# Altium schematic sheet SD-eMMC.SchDoc
size A4
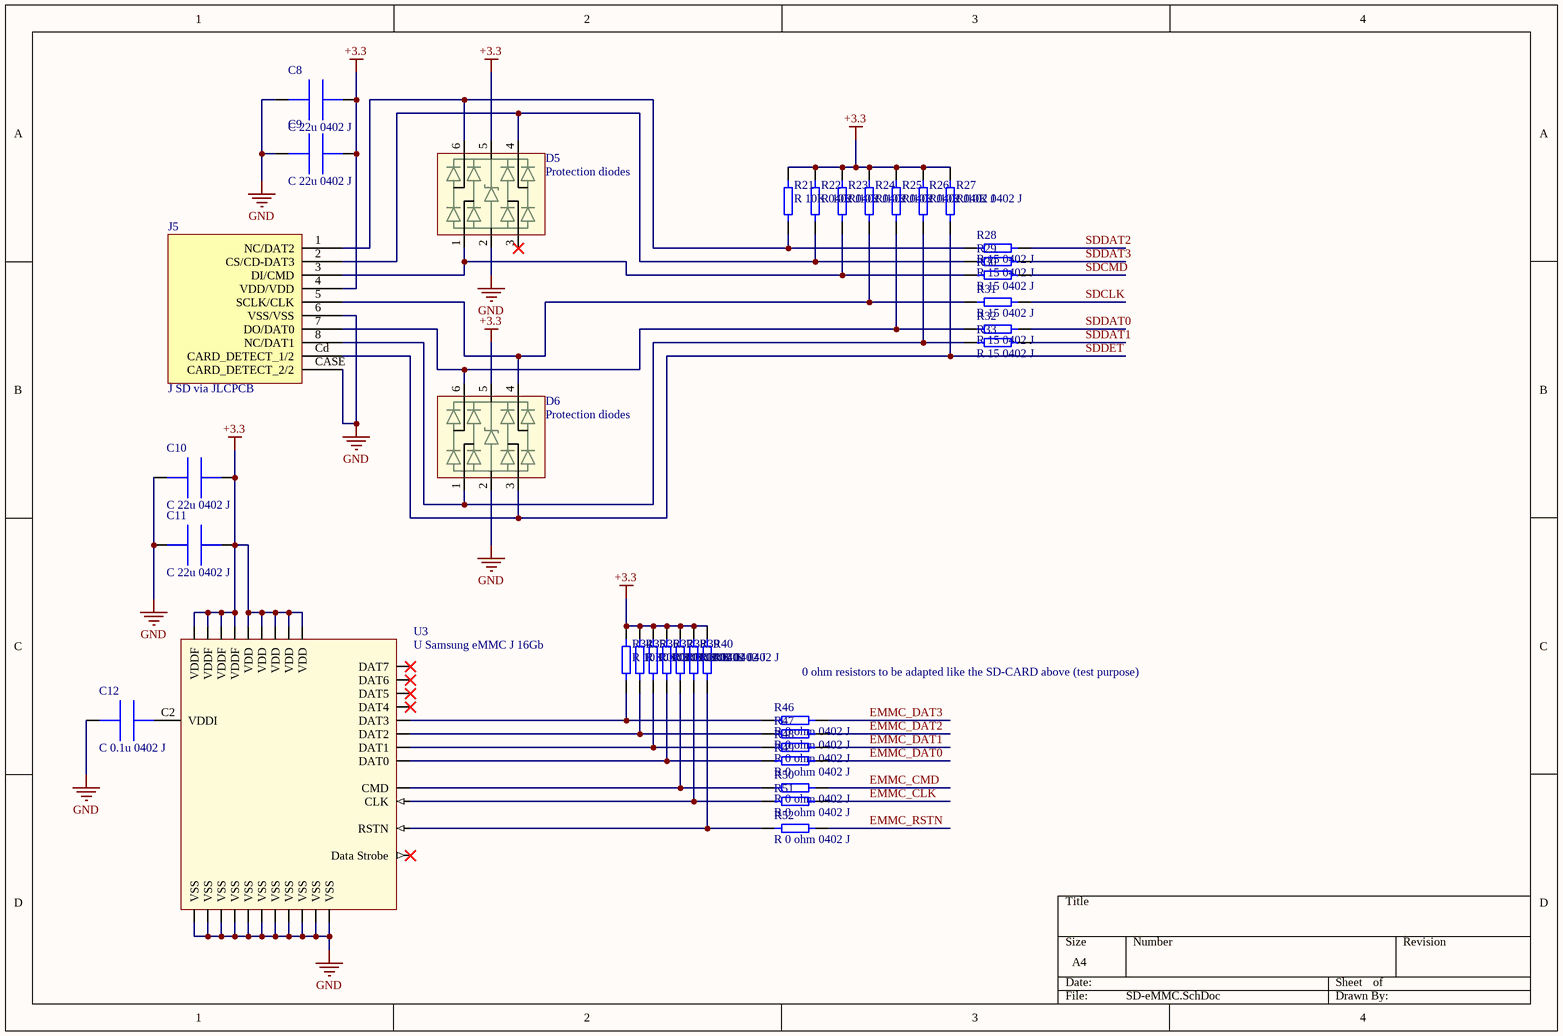
[diagram p0: SD-eMMC.SchDoc]

## Parts
C8  C 22u 0402 J  [C0402]
C9  C 22u 0402 J  [C0402]
C10  C 22u 0402 J  [C0402]
C11  C 22u 0402 J  [C0402]
C12  C 0.1u 0402 J  [C0402]
D5  Protection diodes  [SOT23-SRV05]
D6  Protection diodes  [SOT23-SRV05]
J5  J SD via JLCPCB  [SOFNG TF-15X15 SD JLCPCB]
R21  R 10K 0402 J  [R0402]
R22  R 10K 0402 J  [R0402]
R23  R 10K 0402 J  [R0402]
R24  R 10K 0402 J  [R0402]
R25  R 10K 0402 J  [R0402]
R26  R 10K 0402 J  [R0402]
R27  R 10K 0402 J  [R0402]
R28  R 15 0402 J  [R0402]
R29  R 15 0402 J  [R0402]
R30  R 15 0402 J  [R0402]
R31  R 15 0402 J  [R0402]
R32  R 15 0402 J  [R0402]
R33  R 15 0402 J  [R0402]
R34  R 10K 0402 J  [R0402]
R35  R 10K 0402 J  [R0402]
R36  R 10K 0402 J  [R0402]
R37  R 10K 0402 J  [R0402]
R38  R 10K 0402 J  [R0402]
R39  R 10K 0402 J  [R0402]
R40  R 10K 0402 J  [R0402]
R46  R 0 ohm 0402 J  [R0402]
R47  R 0 ohm 0402 J  [R0402]
R48  R 0 ohm 0402 J  [R0402]
R49  R 0 ohm 0402 J  [R0402]
R50  R 0 ohm 0402 J  [R0402]
R51  R 0 ohm 0402 J  [R0402]
R52  R 0 ohm 0402 J  [R0402]
U3  U Samsung eMMC J 16Gb  [BGA153C50P14X14_1150X1300X92]

## Nets
+3.3: C8.2 C9.2 C10.2 C11.2 D5.5 D6.5 J5.4(VDD/VDD) R21.2 R22.2 R23.2 R24.2 R25.2 R26.2 R27.2 R34.2 R35.2 R36.2 R37.2 R38.1 R39.2 R40.1 U3.C6(VDD) U3.E6(VDDF) U3.F5(VDDF) U3.J10(VDDF) U3.K9(VDDF) U3.M4(VDD) U3.N4(VDD) U3.P3(VDD) U3.P5(VDD)
GND: C8.1 C9.1 C10.1 C11.1 C12.1 D5.2 D6.2 J5.6(VSS/VSS) J5.CASE(CARD_DETECT_2/2) U3.A6(VSS) U3.C4(VSS) U3.E7(VSS) U3.G5(VSS) U3.H10(VSS) U3.J5(VSS) U3.K8(VSS) U3.N2(VSS) U3.N5(VSS) U3.P4(VSS) U3.P6(VSS)
EMMC_CLK: R51.2
EMMC_CMD: R50.2
EMMC_DAT0: R49.2
EMMC_DAT1: R48.2
EMMC_DAT2: R47.2
EMMC_DAT3: R46.2
EMMC_RSTN: R52.2
SDCLK: R31.2
SDCMD: R30.2
SDDAT0: R32.2
SDDAT1: R33.2
SDDAT2: R28.2
SDDAT3: R29.2
SDDET: D6.3 J5.Cd(CARD_DETECT_1/2) R27.1
NetC12_2: C12.2 U3.C2(VDDI)
NetD5_1: D5.1 J5.3(DI/CMD) R23.1 R30.1
NetD5_4: D5.4 J5.2(CS/CD-DAT3) R22.1 R29.1
NetD5_6: D5.6 J5.1(NC/DAT2) R21.1 R28.1
NetD6_1: D6.1 J5.8(NC/DAT1) R26.1 R33.1
NetD6_4: D6.4 J5.5(SCLK/CLK) R24.1 R31.1
NetD6_6: D6.6 J5.7(DO/DAT0) R25.1 R32.1
NetR34_1: R34.1 R46.1 U3.B2(DAT3)
NetR35_1: R35.1 R47.1 U3.A5(DAT2)
NetR36_1: R36.1 R48.1 U3.A4(DAT1)
NetR37_1: R37.1 R49.1 U3.A3(DAT0)
NetR38_2: R38.2 R50.1 U3.M5(CMD)
NetR39_1: R39.1 R51.1 U3.M6(CLK)
NetR40_2: R40.2 R52.1 U3.K5(RSTN)

Not connected (* = marked no-connect by the designer): D5 3*; U3 B3(DAT4)* B4(DAT5)* B5(DAT6)* B6(DAT7)* H5(Data_Strobe)*

## Notes on the sheet
- 0 ohm resistors to be adapted like the SD-CARD above (test purpose)

## Library data of the parts
C8-C11 = C 22u 0402 J: Multi-Layer Ceramic Capacitor 22uF 2.5VDC X6S 20% 0402 Paper T/R GRM155C80E226ME11D; Manufacturer: Murata; Supplier 1: Mouser; Manufacturer Part Number: GRM155C80E226ME11D; RoHS: Yes; Category: Ceramic Capacitors; Stock 1: 30000; Pricing 1: 1=0,32000, 10=0,22300, 50=0,22300, 100=0,13400, 1000=0,08500, 10000=0,06900 (USD); Supplier Part Number 1: 81-GRM155C80E226ME1D; JLCPCB: C907955
C12 = C 0.1u 0402 J: Cap Ceramic 0.1uF 50V X7R 10% Pad SMD 0402 125C Low ESR Automotive CL05B104KB54PNC; Manufacturer: Samsung; Supplier 1: Digi-Key; Manufacturer Part Number: CL05B104KB54PNC; RoHS: Yes; Category: Ceramic Capacitors; Stock 1: 3863336; Pricing 1: 1=0,10000, 10=0,04600, 50=0,02500, 100=0,02040, 500=0,01460, 1000=0,01147, 2500=0,01043, 5000=0,00959 (USD); RoHS Compliant: Yes; Supplier Part Number 1: 1276-CL05B104KB54PNCCT-ND; JLCPCB: C307331
D5 D6 = D SRV05-4.TCT: SEMTECH - SRV05-4.TCT - ESD Protection Device, TVS, 17.5 V, SOT-23, 6 Pins, 5 V, 300 W; Capacitance: 5pF; Direction: Unidirectional; Reverse Breakdown Voltage: 6V; Number of Elements: 1; Number of Channels: 4; Operating Supply Voltage: 5V; Clamping Voltage: 17.5V; Peak Pulse Power: 300W; Power Line Protection: Yes; Leakage Current: 5uA; Peak Pulse Current: 12A; Test Current: 1mA; Current: 5A; Supplier 1: RSComponents; Manufacturer: Semtech; Manufacturer Part Number: SRV05-4.TCT; RoHS: Yes; Category: TVS Diodes; Stock 1: 425; Pricing 1: 5=1,18100, 25=0,88900, 50=0,77200, 125=0,72400, 250=0,69400 (USD); Mount: Surface Mount; Case/Package: SOT-23; Number of Pins: 6; Min Operating Temperature: -55°C; Max Operating Temperature: 125°C; Packaging: Tape and Reel; Number of Bidirectional Channels: 4; Reverse Standoff Voltage: 5V; Min Breakdown Voltage: 6V; Polarity: Unidirectional; Working Voltage: 5V; ESD Protection: Yes; Max Reverse Leakage Current: 5uA; Max Breakdown Voltage: 6V; Max Power Dissipation: 300W; Voltage Rating (DC): 5V; Breakdown Voltage: 6V; Voltage: 5V; Series: RailClamp®, SR; Clamping Voltage-Max: 17.5V; Length: 2.9mm; Width: 1.6mm; Height: 1.15mm; Depth: 1.6mm; Radiation Hardening: No; REACH SVHC: No SVHC; Lead Free: Lead Free; RoHS Compliant: Yes; ComponentLink1URL: https://datasheet.ciiva.com/18065/getdatasheetpartid-93542-18065216.pdf?src-supplier=Verical; ComponentLink1Description: https://datasheet.ciiva.com/18065/getdatasheetpartid-93542-18065216.pdf?src-supplier=Verical; ComponentLink2URL: https://datasheet.ciiva.com/8029/srv05-4-8029973.pdf?src-supplier=Element14; ComponentLink2Description: https://datasheet.ciiva.com/8029/srv05-4-8029973.pdf?src-supplier=Element14; ComponentLink3URL: https://datasheet.ciiva.com/26787/srv05-4-tct-26787453.pdf?src-supplier=IIIC; ComponentLink3Description: https://datasheet.ciiva.com/26787/srv05-4-tct-26787453.pdf?src-supplier=IIIC; ComponentLink4URL: https://datasheet.ciiva.com/11193/srv05-4-11193639.pdf?src-supplier=Avnet; ComponentLink4Description: https://datasheet.ciiva.com/11193/srv05-4-11193639.pdf?src-supplier=Avnet; ComponentLink5URL: https://datasheet.ciiva.com/16396/srv05-4-16396600.pdf?src-supplier=Future+Electronics; ComponentLink5Description: https://datasheet.ciiva.com/16396/srv05-4-16396600.pdf?src-supplier=Future+Electronics; ComponentLink6URL: https://datasheet.ciiva.com/25955/srv05-4-25955769.pdf?src-supplier=Avnet+Europe; ComponentLink6Description: https://datasheet.ciiva.com/25955/srv05-4-25955769.pdf?src-supplier=Avnet+Europe; ComponentLink7URL: https://datasheet.ciiva.com/338/srv05-4-338860.pdf?src-supplier=Digi-Key; ComponentLink7Description: https://datasheet.ciiva.com/338/srv05-4-338860.pdf?src-supplier=Digi-Key; ComponentLink8URL: https://datasheet.ciiva.com/338/srv05-4-338861.pdf?src-supplier=Digi-Key; ComponentLink8Description: https://datasheet.ciiva.com/338/srv05-4-338861.pdf?src-supplier=Digi-Key; ComponentLink9URL: https://datasheet.ciiva.com/338/srv05-4-338862.pdf?src-supplier=Digi-Key; ComponentLink9Description: https://datasheet.ciiva.com/338/srv05-4-338862.pdf?src-supplier=Digi-Key; Supplier Part Number 1: 6910883; JLCPCB: C13612
J5 = J SD via JLCPCB: Deck MicroSD card (TF card) Self bomb SMD SD Card Connectors ROHS; Manufacturer: SOFNG; Manufacturer Part Number: TF-15x15; JLCPCB: C111196
R21-R27 R34-R40 = R 10K 0402 J: Res Thick Film 0402 10K Ohm 1% 0.063W(1/16W) ±100ppm/C Pad SMD Automotive T/R AC0402FR-0710KL; Manufacturer: Yageo; Resistance: 10kR; Power Rating: 62.5mW; Voltage Rating: 50V; Temperature Coefficient: 100ppm/°C; Max Power Dissipation: 63mW; Supplier 1: Arrow Electronics; Manufacturer Part Number: AC0402FR-0710KL; RoHS: Yes; Category: Chip SMD Resistors; Stock 1: 46; Pricing 1: 1=0,08140, 10=0,02850, 25=0,02750 (USD); Case/Package: 0402; Case Code (Imperial): 0402; Case Code (Metric): 1005; Size Code: 0402; Min Operating Temperature: -55°C; Max Operating Temperature: 155°C; Tolerance: 1%; Packaging: Tape and Reel; Resistor Type: Thick Film; Termination: SMD/SMT; Number of Terminations: 2; Features: Moisture Resistant,Automotive AEC-Q200; Series: AC; Construction: Rectangular; Length: 0.039inch; Width: 0.02inch; Height: 0.015inch; Depth: 0.5mm; Military Standard: Not; Lead Free: Lead Free; RoHS Compliant: Yes; ComponentLink1URL: https://datasheet.ciiva.com/12656/pyu-ac-51-rohs-l-2-12656634.pdf?src-supplier=Mouser; ComponentLink1Description: https://datasheet.ciiva.com/12656/pyu-ac-51-rohs-l-2-12656634.pdf?src-supplier=Mouser; Supplier 2: RSComponents; Stock 2: 17000; Pricing 2: 10000=0,00200 (GBP); Supplier 3: Digi-Key; Stock 3: 1574588; Pricing 3: 1=0,10000, 10=0,02000, 100=0,00830, 1000=0,00371, 2500=0,00322, 5000=0,00266 (USD); Supplier 4: Mouser; Stock 4: 3990115; Pricing 4: 1=0,10000, 10=0,01500, 50=0,01500, 100=0,00700, 1000=0,00300, 5000=0,00200, 10000=0,00200 (USD); Supplier Part Number 1: AC0402FR-0710KL; Supplier Part Number 2: 1977965; Supplier Part Number 3: YAG3436CT-ND; Supplier Part Number 4: 603-AC0402FR-0710KL; JLCPCB: C144807
R28-R33 = R 15 0402 J: Res Thick Film 0402 15 Ohm 5% 1/10W ±200ppm/°C Molded SMD Punched Carrier T/R ERJ-2GEJ150X; Manufacturer: Panasonic; Resistance: 15R; Voltage Rating: 50V; Power Rating: 100mW; Supplier 1: Arrow Electronics; Manufacturer Part Number: ERJ-2GEJ150X; RoHS: Yes; Category: Chip SMD Resistors; Stock 1: 8902; Pricing 1: 1=0,04910, 10=0,01270, 25=0,00660, 100=0,00350, 250=0,00340, 3000=0,00330 (USD); Mount: Surface Mount; Case/Package: 0402; Contact Plating: Tin; Case Code (Imperial): 0402; Case Code (Metric): 1005; Min Operating Temperature: -55°C; Max Operating Temperature: 155°C; Tolerance: 5%; Resistor Type: Thick Film; Temperature Coefficient: 200ppm/°C; Packaging: Tape and Reel; Package Quantity: 1; Termination: SMD/SMT; Number of Terminations: 2; Max Power Dissipation: 100mW; Voltage Rating (DC): 50V; Features: Automotive AEC-Q200; Series: ERJ; Resistance Tolerance: 5%; Technology: THICK FILM; Construction: Rectangular; Length: 1mm; Width: 0.5mm; Height: 0.35mm; Depth: 0.5mm; Radiation Hardening: No; REACH SVHC: No SVHC; Military Standard: Not; Lead Free: Lead Free; RoHS Compliant: Yes; ComponentLink1URL: https://datasheet.ciiva.com/11821/0900766b80f806dd-11821198.pdf?src-supplier=RSComponents; ComponentLink1Description: https://datasheet.ciiva.com/11821/0900766b80f806dd-11821198.pdf?src-supplier=RSComponents; ComponentLink2URL: https://datasheet.ciiva.com/8081/aoa0000ce1-8081306.pdf?src-supplier=Element14; ComponentLink2Description: https://datasheet.ciiva.com/8081/aoa0000ce1-8081306.pdf?src-supplier=Element14; ComponentLink3URL: https://datasheet.ciiva.com/43470/1678796-43470027.pdf?src-supplier=Farnell; ComponentLink3Description: https://datasheet.ciiva.com/43470/1678796-43470027.pdf?src-supplier=Farnell; ComponentLink4URL: https://datasheet.ciiva.com/46380/1678796-46380221.pdf?src-supplier=Element14; ComponentLink4Description: https://datasheet.ciiva.com/46380/1678796-46380221.pdf?src-supplier=Element14; ComponentLink5URL: https://datasheet.ciiva.com/16774/70260739-16774952.pdf?src-supplier=Allied+Electronics; ComponentLink5Description: https://datasheet.ciiva.com/16774/70260739-16774952.pdf?src-supplier=Allied+Electronics; ComponentLink6URL: https://datasheet.ciiva.com/9119/aoa0000ce1-9119005.pdf?src-supplier=Avnet; ComponentLink6Description: https://datasheet.ciiva.com/9119/aoa0000ce1-9119005.pdf?src-supplier=Avnet; Supplier 2: Mouser; Stock 2: 72720; Pricing 2: 1=0,10000, 10=0,02900, 50=0,02900, 100=0,01200, 1000=0,00600, 2500=0,00500, 5000=0,00400, 10000=0,00400 (USD); Supplier 3: RSComponents; JLCPCB: C412910; Supplier Part Number 1: ERJ-2GEJ150X; Supplier Part Number 2: 667-ERJ-2GEJ150X; Supplier Part Number 3: 7324921
R46-R52 = R 0 ohm 0402 J: RC Series 0402 0.063 W 0 Ohm Jumper Surface Mount Thick Film Chip Resistor RC0402FR-070RL; Manufacturer: Yageo; Resistance: 0R; Tolerance: 1%; Power Rating: 62.5mW; Voltage Rating: 50V; Temperature Coefficient: 200ppm/°C; Max Power Dissipation: 63mW; Supplier 1: Arrow Electronics; Manufacturer Part Number: RC0402FR-070RL; RoHS: Yes; Category: Chip SMD Resistors; Stock 1: 810000; Pricing 1: 10000=0,00120, 30000=0,00110, 50000=0,00100 (USD); Mount: Surface Mount; Case/Package: 0402; Contact Plating: Tin,Matte; Case Code (Imperial): 0402; Case Code (Metric): 1005; Size Code: 0402; Min Operating Temperature: -55°C; Max Operating Temperature: 155°C; Resistor Type: Thick Film; Packaging: Tape and Reel; Termination: SMD/SMT; Features: Moisture Resistant; Series: RC; Number of Terminations: 2; Length: 1mm; Width: 0.5mm; Height: 0.35mm; Radiation Hardening: No; Lead Free: Lead Free; RoHS Compliant: Yes; ComponentLink1URL: https://datasheet.ciiva.com/8896/pyu-rc0402-51-rohs-l-6-8896149.pdf?src-supplier=Avnet; ComponentLink1Description: https://datasheet.ciiva.com/8896/pyu-rc0402-51-rohs-l-6-8896149.pdf?src-supplier=Avnet; ComponentLink2URL: https://datasheet.ciiva.com/16790/pyu-rc0402-51-rohs-l-6-r-16790444.pdf?src-supplier=Future+Electronics; ComponentLink2Description: https://datasheet.ciiva.com/16790/pyu-rc0402-51-rohs-l-6-r-16790444.pdf?src-supplier=Future+Electronics; Supplier 2: Digi-Key; Stock 2: 9382775; Pricing 2: 1=0,10000, 10=0,01200, 25=0,00840, 50=0,00640, 100=0,00480, 250=0,00364, 500=0,00290, 1000=0,00214, 5000=0,00154 (USD); Supplier 3: Mouser; Stock 3: 8133261; Pricing 3: 1=0,10000, 10=0,01400, 50=0,01400, 100=0,00600, 1000=0,00300, 5000=0,00200, 10000=0,00100 (USD); JLCPCB: C106231; Supplier Part Number 1: RC0402FR-070RL; Supplier Part Number 2: 311-0.0LRCT-ND; Supplier Part Number 3: 603-RC0402FR-070RL
U3 = U Samsung eMMC J 16Gb: KLMAG1JETD-B041 16Gbit -25℃~+85℃ 2.7V~3.6V eMMC 5.1 FBGA-153 eMMC ROHS; Supplier 1: Arrow Electronics; Manufacturer: Samsung; Manufacturer Part Number: KLMAG1JETD-B041; RoHS: No; JLCPCB: C499919; Supplier Part Number 1: KLMAG1JETD-B0410